# EAGLE design sevseg_interface (EAGLE 9.0.1)
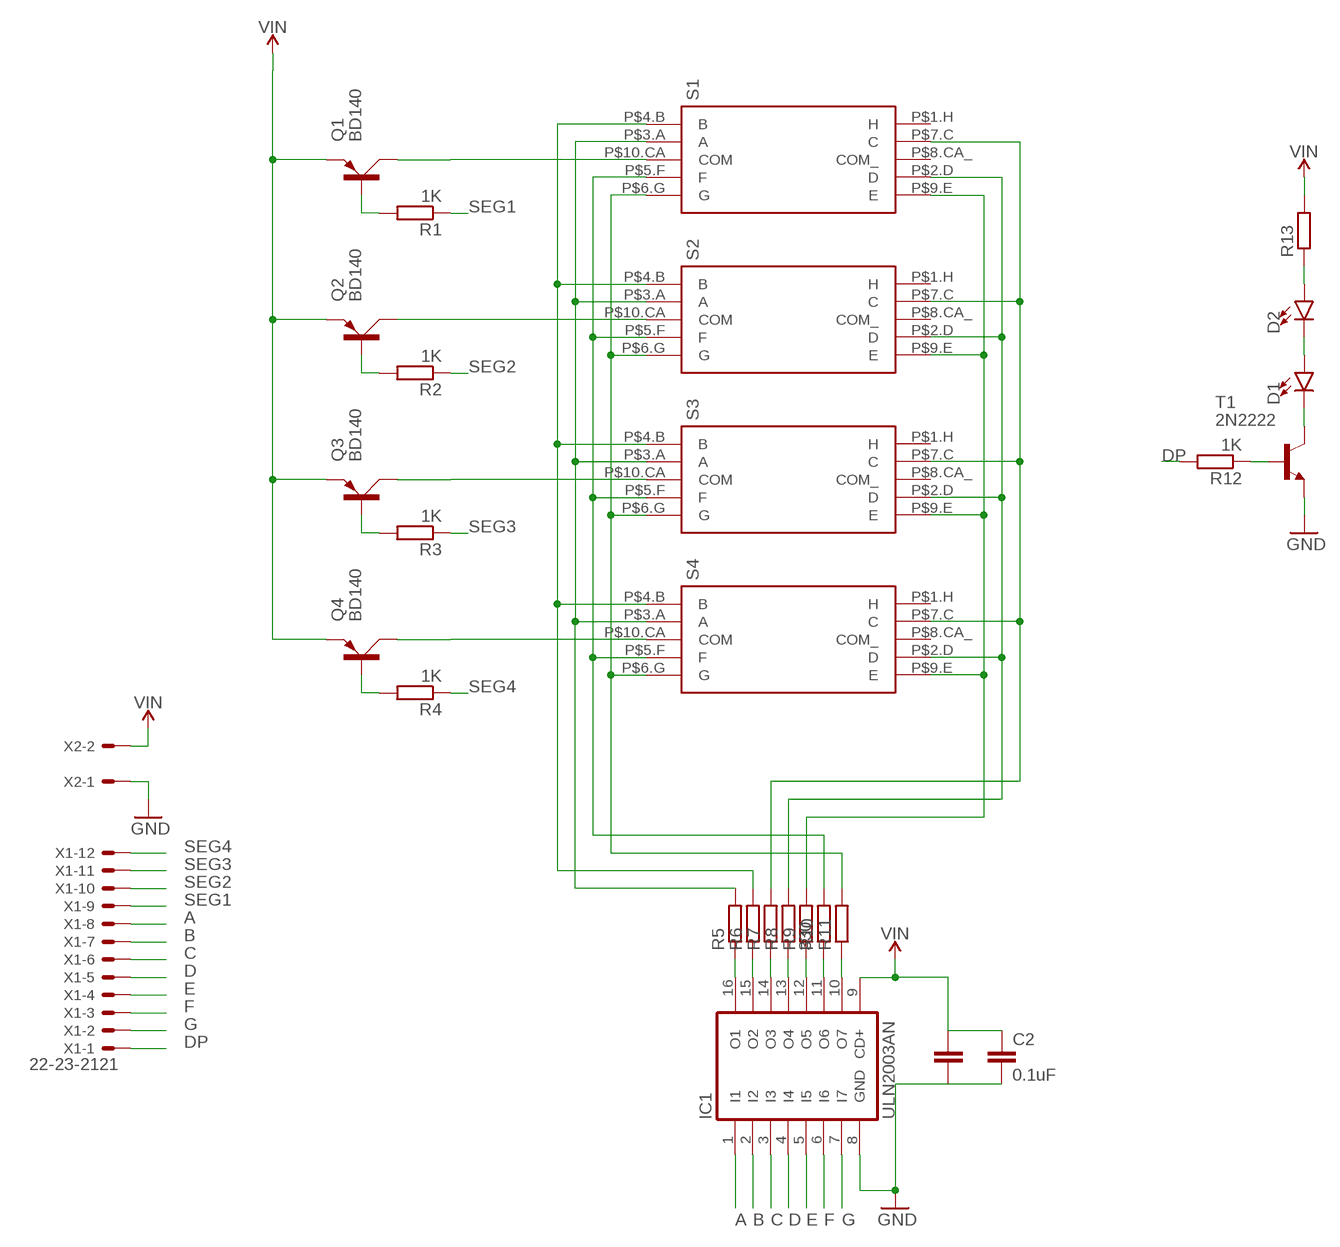
[diagram p0: schematic, sheet 1]

## Parts
C2  0.1uF  0.1UF-KIT-EZ-50V-20%  [CAP-PTH-SMALL-KIT]
D1  LED5MM  [LED_5MM]
D2  LED5MM  [LED_5MM]
IC1  ULN2003AN  [DIL16]
Q1  BD140  [TO126AV]
Q2  BD140  [TO126AV]
Q3  BD140  [TO126AV]
Q4  BD140  [TO126AV]
R1  1K  R-EU_0204/7  [0204/7]
R2  1K  R-EU_0204/7  [0204/7]
R3  1K  R-EU_0204/7  [0204/7]
R4  1K  R-EU_0204/7  [0204/7]
R5  R-EU_0204/7  [0204/7]
R6  R-EU_0204/7  [0204/7]
R7  R-EU_0204/7  [0204/7]
R8  330  R-EU_0204/7  [0204/7]
R9  R-EU_0204/7  [0204/7]
R10  R-EU_0204/7  [0204/7]
R11  R-EU_0204/7  [0204/7]
R12  1K  R-EU_0204/7  [0204/7]
R13  R-EU_0204/7  [0204/7]
S1  7SEG_2.3IN_70MM_CA  [2.3INCH_70MM]
S2  7SEG_2.3IN_70MM_CA  [2.3INCH_70MM]
S3  7SEG_2.3IN_70MM_CA  [2.3INCH_70MM]
S4  7SEG_2.3IN_70MM_CA  [2.3INCH_70MM]
T1  2N2222  [TO18]
X1  22-23-2121  [22-23-2121]
X2  KK-156-2  [KK-156-2]

## Nets
A: IC1.1(I1) X1.8
B: IC1.2(I2) X1.7
C: IC1.3(I3) X1.6
D: IC1.4(I4) X1.5
DP: R12.2 X1.1
E: IC1.5(I5) X1.4
F: IC1.6(I6) X1.3
G: IC1.7(I7) X1.2
GND: C2.2 IC1.8(GND) T1.1(E) X2.1
N$1: R6.2 S1.P$4.B(B) S2.P$4.B(B) S3.P$4.B(B) S4.P$4.B(B)
N$2: R5.2 S1.P$3.A(A) S2.P$3.A(A) S3.P$3.A(A) S4.P$3.A(A)
N$3: Q1.C S1.P$10.CA(COM)
N$4: Q2.C S2.P$10.CA(COM)
N$5: Q3.C S3.P$10.CA(COM)
N$6: Q4.C S4.P$10.CA(COM)
N$7: R10.2 S1.P$5.F(F) S2.P$5.F(F) S3.P$5.F(F) S4.P$5.F(F)
N$8: R11.2 S1.P$6.G(G) S2.P$6.G(G) S3.P$6.G(G) S4.P$6.G(G)
N$9: R7.2 S1.P$7.C(C) S2.P$7.C(C) S3.P$7.C(C) S4.P$7.C(C)
N$11: R8.2 S1.P$2.D(D) S2.P$2.D(D) S3.P$2.D(D) S4.P$2.D(D)
N$12: R9.2 S1.P$9.E(E) S2.P$9.E(E) S3.P$9.E(E) S4.P$9.E(E)
N$13: R12.1 T1.2(B)
N$14: Q2.B R2.2
N$15: Q3.B R3.2
N$16: Q4.B R4.2
N$17: Q1.B R1.2
N$18: IC1.16(O1) R5.1
N$19: IC1.15(O2) R6.1
N$20: IC1.14(O3) R7.1
N$21: IC1.13(O4) R8.1
N$22: IC1.12(O5) R9.1
N$23: IC1.11(O6) R10.1
N$24: IC1.10(O7) R11.1
N$26: D1.K(C) T1.3(C)
N$27: D1.A D2.K(C)
N$28: D2.A R13.1
SEG1: R1.1 X1.9
SEG2: R2.1 X1.10
SEG3: R3.1 X1.11
SEG4: R4.1 X1.12
VIN: C2.1 IC1.9(CD+) Q1.E Q2.E Q3.E Q4.E R13.2 X2.2
Unconnected: S1.P$1.H(H) S1.P$8.CA_(COM_) S2.P$1.H(H) S2.P$8.CA_(COM_) S3.P$1.H(H) S3.P$8.CA_(COM_) S4.P$1.H(H) S4.P$8.CA_(COM_)

## Library data of the parts
C2 = SparkFun-Capacitors:0.1UF: 0.1µF ceramic capacitors A capacitor is a passive two-terminal electrical component used to store electrical energy temporarily in an electric field.; PROD_ID: CAP-08370
D1 D2 = SparkFun-LED:LED: LED (Generic) Standard schematic elements and footprints for 5mm, 3mm, 1206, and 0603 sized LEDs. Generic LEDs with no color specified.
IC1 = uln-udn:ULN2003A: DRIVER ARRAY
Q1-Q4 = transistor-power:BD140: PNP TRANSISTOR
R1-R4 R12 = resistor:R-EU_: RESISTOR, European symbol
R5-R11 R13 = rcl:R-EU_: RESISTOR, European symbol; SPICEPREFIX: R
S1-S4 = seven_segment:7SEG_2.3IN_70MM_CA
T1 = transistor:2N2222: NPN TRANSISTOR
X1 = con-molex:22-23-2121: .100" (2.54mm) Center Header - 12 Pin; MF: MOLEX; MPN: 22-23-2121; OC_FARNELL: 1462935; OC_NEWARK: 56H0456
X2 = con-molex:KK-156-2: KK 156 HEADER Source: http://www.molex.com/pdm_docs/sd/026604100_sd.pdf; MF: MOLEX; OC_FARNELL: unknown; OC_NEWARK: unknown

## Board
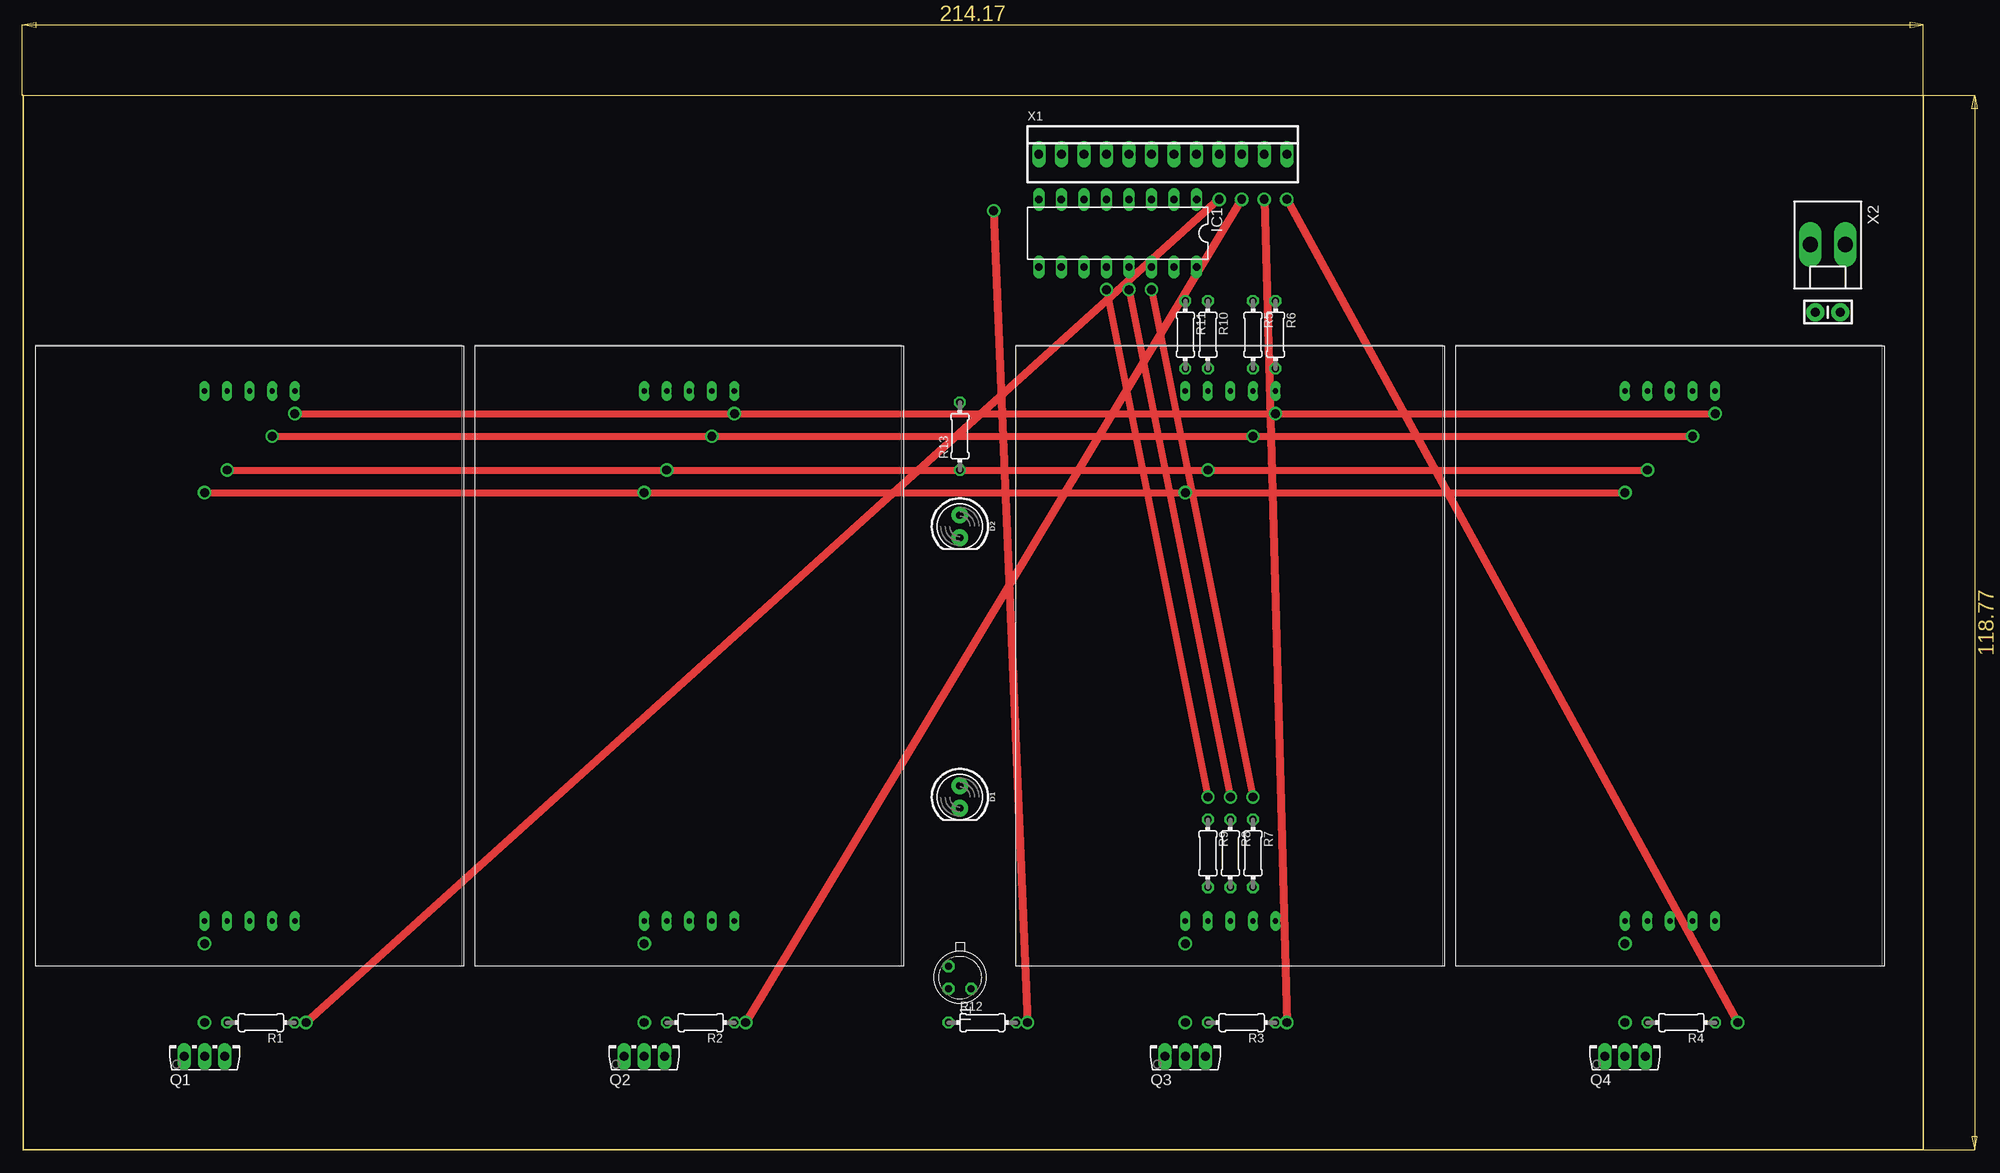
[diagram p1: board, top side]
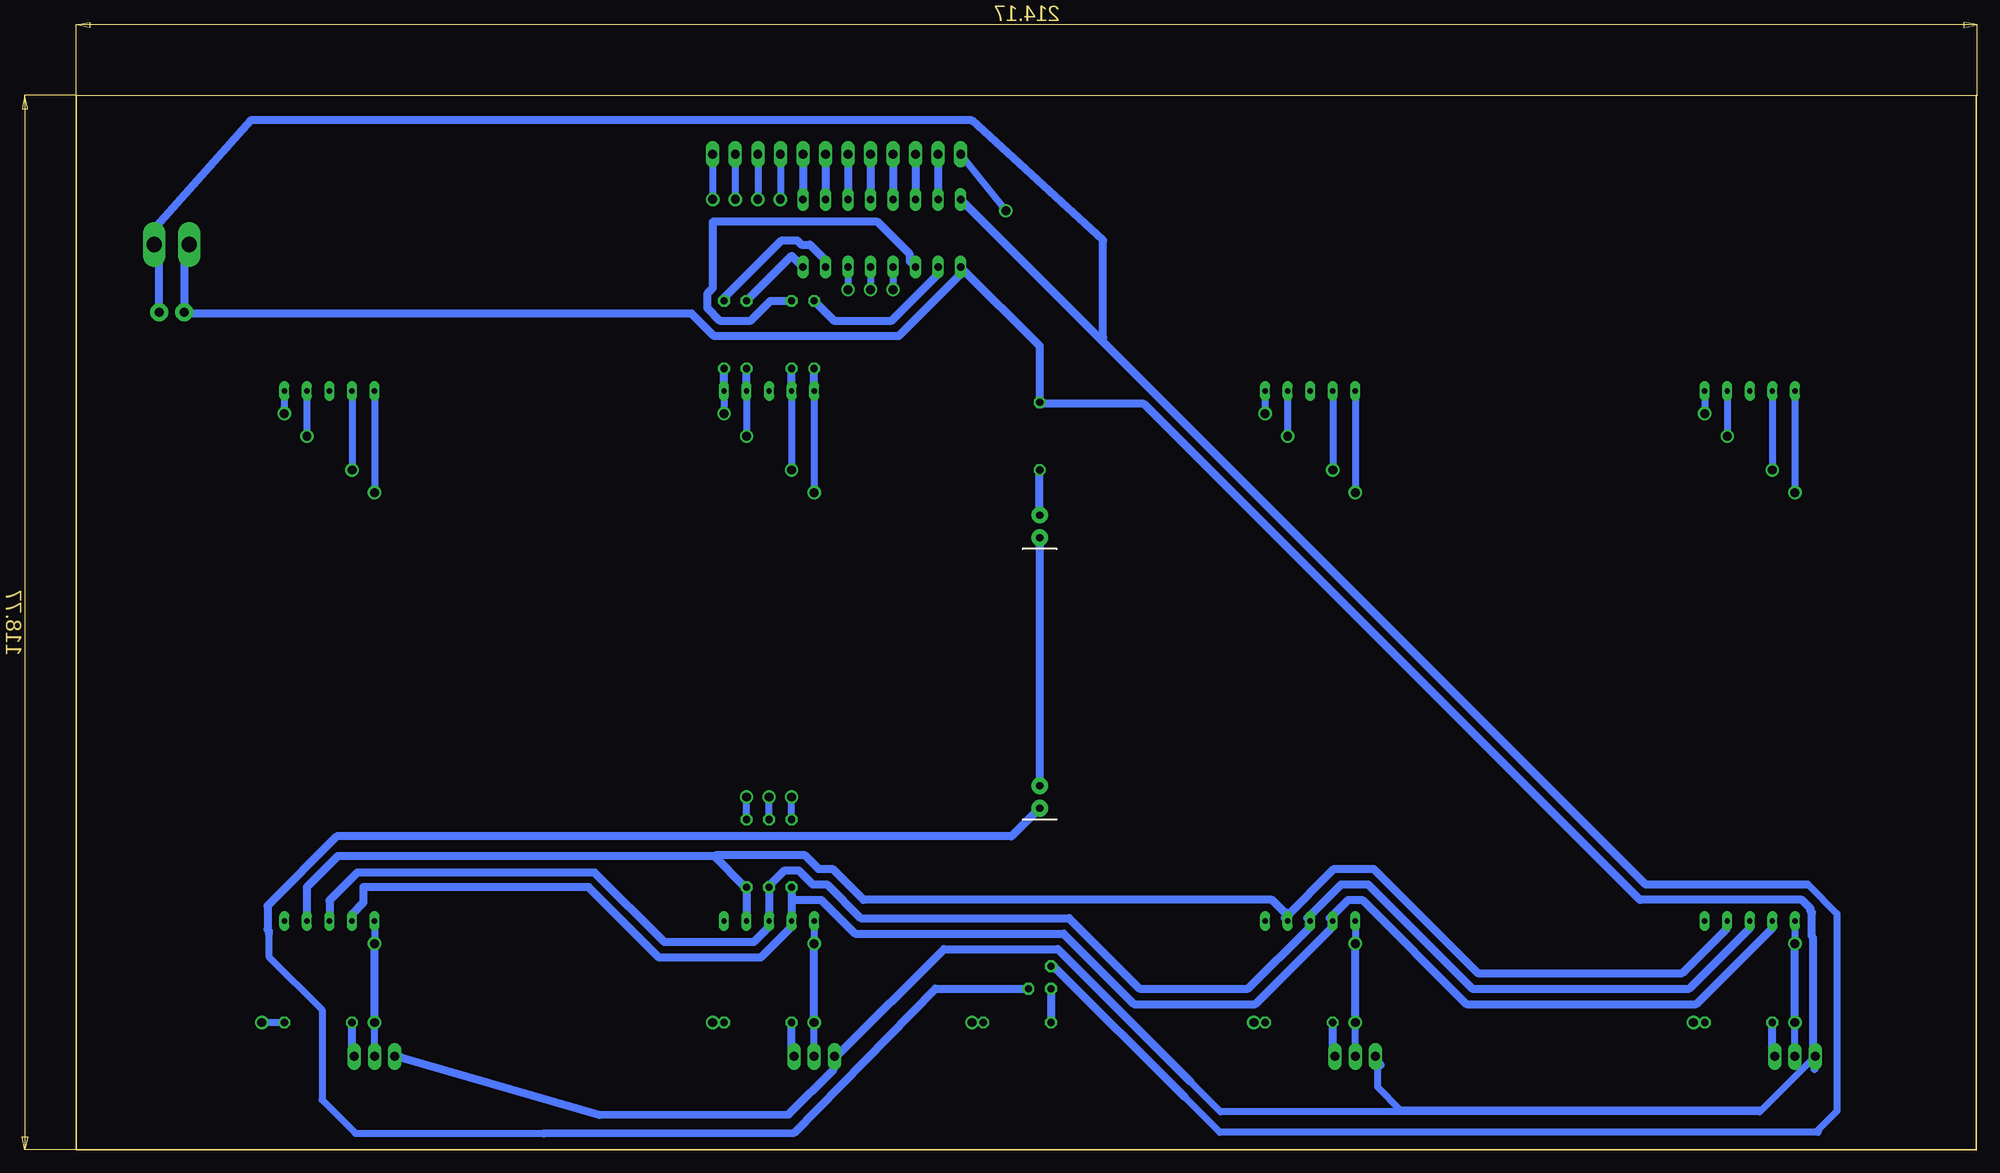
[diagram p2: board, bottom side, seen from below]

Size 214.17 x 118.85 mm. Coordinates in mm from the lower left corner, seen from the top.
Outline: 0,118.82 214.17,118.77
Outline: 0.1,0 0.1,0.05
Outline: 0.1,0.05 0.1,118.82 0.08,118.85
Outline: 214.17,118.82 214.17,0.05 0.1,0.05
Copper layers (1*16): Top 0.035mm / dielectric 1.5mm / Bottom 0.035mm
Design rules "default *": minimum track width 35mil, minimum drill 0.35mm, track to track 30mil, track to pad 30mil, pad to pad 30mil, via to via 6mil, smd to smd 6mil, copper to edge 40mil, drill to drill 25mil, minimum pad ring 10mil, minimum via ring 8mil, stop-mask expansion 4mil, vias tented up to drill 0mil, thermal gap 10mil

### Footprints (pad centres in the part's own frame; a part is rotated, then mirrored left to right if it is on the bottom)
CAP-PTH-SMALL-KIT = drill 1.016 pad 2.032: 1 -1.397,0; 2 1.397,0
LED_5MM = drill 0.813 pad 1.88: A -1.27,0; K 1.27,0
DIL16 = drill 0.813 long: 1 -8.89,-3.81; 2 -6.35,-3.81; 3 -3.81,-3.81; 4 -1.27,-3.81; 5 1.27,-3.81; 6 3.81,-3.81; 7 6.35,-3.81; 8 8.89,-3.81; 9 8.89,3.81; 10 6.35,3.81; 11 3.81,3.81; 12 1.27,3.81; 13 -1.27,3.81; 14 -3.81,3.81; 15 -6.35,3.81; 16 -8.89,3.81
TO126AV = drill 1.016 long: B 2.286,-1.27; C 0,-1.27; E -2.286,-1.27
0204/7 = drill 0.813 octagon: 1 -3.81,0; 2 3.81,0
2.3INCH_70MM = drill 0.6 long: P$1.H 24.13,64.77; P$2.D 24.13,5.08; P$3.A 26.67,64.77; P$4.B 29.21,64.77; P$5.F 21.59,64.77; P$6.G 19.05,64.77; P$7.C 26.67,5.08; P$8.CA_ 29.21,5.08; P$9.E 21.59,5.08; P$10.CA 19.05,5.08
TO18 = drill 0.813 octagon: 1 -1.27,-1.27; 2 1.27,-1.27; 3 1.27,1.27
22-23-2121 = drill 1 long: 1 -13.97,0; 2 -11.43,0; 3 -8.89,0; 4 -6.35,0; 5 -3.81,0; 6 -1.27,0; 7 1.27,0; 8 3.81,0; 9 6.35,0; 10 8.89,0; 11 11.43,0; 12 13.97,0
KK-156-2 = drill 1.7 pad 2.184 long: 1 -1.98,0; 2 1.98,0

### Placement (x,y rotation side)
C2  203.43,94.41 0 top
D1  105.64,39.8 270 top
D2  105.64,70.28 270 top
IC1  123.42,103.3 180 top
Q1  20.55,11.86 0 top
Q2  70.08,11.86 0 top
Q3  131.04,11.86 0 top
Q4  180.57,11.86 0 top
R1  26.9,14.4 180 top
R2  76.43,14.4 180 top
R3  137.39,14.4 180 top
R4  186.92,14.4 180 top
R5  138.66,91.87 270 top
R6  141.2,91.87 270 top
R7  138.66,33.45 270 top
R8  136.12,33.45 270 top
R9  133.58,33.45 270 top
R10  133.58,91.87 270 top
R11  131.04,91.87 270 top
R12  108.18,14.4 0 top
R13  105.64,80.44 90 top
S1  1.5,20.75 0 top
S2  51.03,20.75 0 top
S3  111.99,20.75 0 top
S4  161.52,20.75 0 top
T1  105.64,19.48 270 top
X1  128.5,112.19 0 top
X2  203.43,102.03 180 top

### Tracks (layer width: path | path; a pad name or v marks a point on that pad's centre or on a via)
A
  Bottom 0.889: X1.8 IC1.1
B
  Bottom 0.889: X1.7 IC1.2
C
  Bottom 0.889: X1.6 IC1.3
D
  Bottom 0.889: X1.5 IC1.4
DP  (via drill 1)
  Top 0.889: v109.45,105.84 v113.26,14.4
  Bottom 0.813: R12.2 v113.26,14.4 | X1.1 v109.45,105.84
E
  Bottom 0.889: X1.4 IC1.5
F
  Bottom 0.889: X1.3 IC1.6
G
  Bottom 0.889: X1.2 IC1.7
GND
  Bottom 0.813: 19.12,29.96 15.82,26.66 15.82,4.42 17.93,2.31 17.93,2.03 85.33,2.03 89.29,5.99
  Bottom 0.889: C2.2 204.86,94.41 204.86,101.56 205.33,102.03 X2.1 205.17,102.35 205.17,104.1 194.54,116 113.26,116 98.49,102.51 98.49,91.55 98.73,91.32 | T1.1 104.05,20.75 89.29,5.99 | 19.12,29.96 37.38,29.96 98.73,91.32 | IC1.8 98.73,91.32
N$1  (via drill 1)
  Top 0.813: v30.71,82.98 v80.24,82.98 v141.2,82.98 v190.73,82.98
  Bottom 0.813: S1.P$4.B v30.71,82.98 | S2.P$4.B v80.24,82.98 | S4.P$4.B v190.73,82.98 | S3.P$4.B v141.2,82.98
  Bottom 0.889: S3.P$4.B R6.2
N$2  (via drill 1)
  Top 0.813: v28.17,80.44 v77.7,80.44 v138.66,80.44 v188.19,80.44
  Bottom 0.813: S1.P$3.A v28.17,80.44 | S2.P$3.A v77.7,80.44 | S4.P$3.A v188.19,80.44 | S3.P$3.A v138.66,80.44
  Bottom 0.889: S3.P$3.A R5.2
N$3  (via drill 1)
  Bottom 0.813: S1.P$10.CA v20.55,23.29 | Q1.C v20.55,14.4
  Bottom 0.889: v20.55,14.4 v20.55,23.29
N$4  (via drill 1)
  Bottom 0.813: S2.P$10.CA v70.08,23.29 | Q2.C v70.08,14.4
  Bottom 0.889: v70.08,14.4 v70.08,23.29
N$5  (via drill 1)
  Bottom 0.813: S3.P$10.CA v131.04,23.29 | Q3.C v131.04,14.4
  Bottom 0.889: v131.04,14.4 v131.04,23.29
N$6  (via drill 1)
  Bottom 0.813: S4.P$10.CA v180.57,23.29 | Q4.C v180.57,14.4
  Bottom 0.889: v180.57,14.4 v180.57,23.29
N$7  (via drill 1)
  Top 0.813: v23.09,76.63 v72.62,76.63 v133.58,76.63 v183.11,76.63
  Bottom 0.813: S1.P$5.F v23.09,76.63 | S2.P$5.F v72.62,76.63 | S4.P$5.F v183.11,76.63 | S3.P$5.F v133.58,76.63
  Bottom 0.889: S3.P$5.F R10.2
N$8  (via drill 1)
  Top 0.813: v20.55,74.09 v70.08,74.09 v131.04,74.09 v180.57,74.09
  Bottom 0.813: S1.P$6.G v20.55,74.09 | S2.P$6.G v70.08,74.09 | S4.P$6.G v180.57,74.09 | S3.P$6.G v131.04,74.09
  Bottom 0.889: S3.P$6.G R11.2
N$9
  Bottom 0.889: S1.P$7.C 28.17,25.04 33.25,19.96 56.27,19.96 68.01,31.71 72.46,31.71 78.02,26.15 S2.P$7.C 77.86,26.78 78.02,26.78 79.44,28.21 125.48,28.21 128.97,31.71 130.56,31.71 132.15,33.29 141.99,33.29 142.15,33.13 | S3.P$7.C R7.2 138.98,29.8 142.23,33.05 142.15,33.13 | 188.19,26.63 S4.P$7.C 188.19,29.64 184.7,33.13 142.15,33.13
N$11
  Bottom 0.889: S1.P$2.D 25.63,25.04 32.45,18.21 56.9,18.21 68.65,29.96 71.67,29.96 75.48,26.15 S2.P$2.D 75.32,25.51 75.32,25.04 82.14,18.21 94.37,18.21 102.3,26.15 125.8,26.15 129.61,29.96 131.2,29.96 132.78,31.55 134.37,31.55 135.96,29.96 R8.2 S3.P$2.D 136.12,25.51 135.96,25.36 137.86,23.45 147.91,23.45 155.75,31.29 182.52,31.29 185.65,28.17 S4.P$2.D
N$12
  Bottom 0.889: S1.P$9.E 23.09,25.04 31.66,16.47 57.54,16.47 69.28,28.21 70.87,28.21 72.94,26.15 S2.P$9.E 72.78,25.51 72.78,25.04 81.35,16.47 95,16.47 102.94,24.4 126.43,24.4 130.24,28.21 133.58,28.21 | R9.2 133.58,28.21 | 133.58,28.21 S3.P$9.E 133.58,25.51 133.42,25.36 137.07,21.7 148.5,21.7 156.44,29.64 181.84,29.64 181.84,27.9 183.11,26.63 S4.P$9.E
N$13
  Bottom 0.889: T1.2 R12.1
N$14
  Bottom 0.889: R2.2 72.62,10.75 72.46,10.59 Q2.B
N$15
  Bottom 0.889: R3.2 133.58,10.75 133.42,10.59 Q3.B
N$16
  Bottom 0.889: R4.2 183.11,10.75 182.95,10.59 Q4.B
N$17
  Bottom 0.889: R1.2 23.09,10.75 22.93,10.59 Q1.B
N$18
  Bottom 0.889: R5.1 133.58,100.76 IC1.16
N$19
  Bottom 0.889: IC1.15 129.77,100.29 131.51,102.03 132.47,102.03 132.94,102.51 134.69,102.51 141.36,95.84 R6.1
N$20  (via drill 1)
  Top 0.813: v127.23,96.95 v138.66,39.8
  Bottom 0.813: IC1.14 v127.23,96.95 | R7.1 v138.66,39.8
N$21  (via drill 1)
  Top 0.813: v124.69,96.95 v136.12,39.8
  Bottom 0.813: IC1.13 v124.69,96.95 | R8.1 v136.12,39.8
N$22  (via drill 1)
  Top 0.813: v122.15,96.95 v133.58,39.8
  Bottom 0.813: IC1.12 v122.15,96.95 | R9.1 v133.58,39.8
N$23
  Bottom 0.889: R10.1 135.96,95.68 138.18,93.46 141.67,93.46 143.1,94.89 143.1,96.48 142.47,97.11 142.47,104.57 123.89,104.57 120.24,100.92 120.24,100.13 IC1.11
N$24
  Bottom 0.889: IC1.10 117.07,98.7 122.31,93.46 128.82,93.46 R11.1
N$26
  Bottom 0.813: 192.47,24.72 192.47,21.81 186.49,15.82 186.49,5.69 182.71,1.92 161.49,1.92
  Bottom 0.889: T1.3 117.39,18.21 133.27,1.99 161.49,1.92 | 192.47,24.4 192.47,24.72 192.63,24.88 192.63,27.53 184.81,35.36 108.81,35.36 D1.K
N$27
  Bottom 0.889: D2.K D1.A
N$28
  Bottom 0.889: D2.A R13.1
SEG1  (via drill 1)
  Top 0.889: v134.85,107.11 v31.98,14.4
  Bottom 0.813: R1.1 v31.98,14.4 | X1.9 v134.85,107.11
SEG2  (via drill 1)
  Top 0.889: v137.39,107.11 v81.51,14.4
  Bottom 0.813: R2.1 v81.51,14.4 | X1.10 v137.39,107.11
SEG3  (via drill 1)
  Top 0.889: v139.93,107.11 v142.47,14.4
  Bottom 0.813: R3.1 v142.47,14.4 | X1.11 v139.93,107.11
SEG4  (via drill 1)
  Top 0.889: v142.47,107.11 v193.27,14.4
  Bottom 0.813: R4.1 v193.27,14.4 | X1.12 v142.47,107.11
VIN
  Bottom 0.813: 67.54,10.17 67.54,7.11 64.97,4.55 24.31,4.55 Q1.E 24.51,4.34 85.26,4.34 89.28,8.36
  Bottom 0.889: X2.2 201.52,102.03 202,101.56 202,94.41 C2.1 201.68,94.25 144.85,94.25 142.31,91.71 121.51,91.71 114.37,98.86 IC1.9 105.64,90.6 R13.2 105.32,84.09 93.89,84.09 38.01,28.21 19.75,28.21 18.8,27.26 18.8,26.94 18.64,26.78 18.64,24.09 18.48,23.93 18.48,10.91 Q1.E 18.33,10.59 18.33,9.16 | 67.7,10.59 Q2.E 67.54,10.17 67.22,9.64 | Q4.E 177.6,10.52 155.23,3.99 133.91,4.07 128.82,9.16 128.82,10.59 Q3.E 128.34,10.75 116.43,22.66 103.57,22.66 89.28,8.36 88.65,7.73